# Altium schematic sheet ESP_with_usb_2.SchDoc
size A
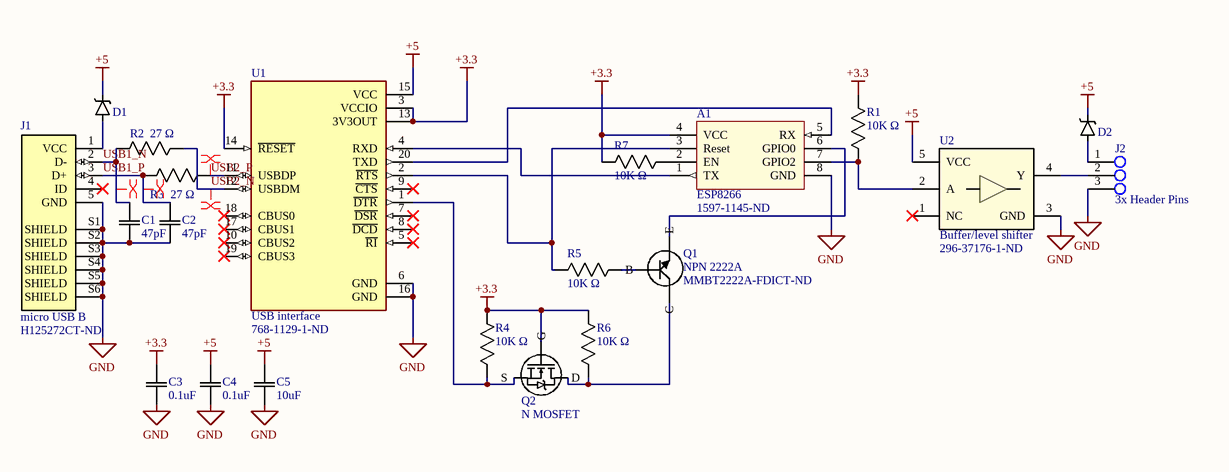
[diagram p0: ESP_with_usb_2.SchDoc]

## Parts
A1  ESP8266  Supplier Part Number 1: 1597-1145-ND  [ESP8266]
C1  47pF  [CC0805N]
C2  47pF  [CC0805N]
C3  0.1uF  [CC0805N]
C4  0.1uF  [CC0805N]
C5  10uF  [CC0805N]
D1  Diode, Schottky  [SOD-323]  (value not drawn)
D2  Diode, Schottky  [SOD-323]  (value not drawn)
J1  micro USB B  Supplier Part Number 1: H125272CT-ND  [Micro USB B (rev 2)]
J2  3x Header Pins  [3 HEADER PIN]
Q1  NPN 2222A  Supplier Part Number 1: MMBT2222A-FDICT-ND  [SOT-23-3]
Q2  N MOSFET  [SOT-323]
R1  10K Ω  [CC0805N]
R2  27 Ω  [CC0805N]
R3  27 Ω  [CC0805N]
R4  10K Ω  [CC0805N]
R5  10K Ω  [CC0805N]
R6  10K Ω  [CC0805N]
R7  10K Ω  [CC0805N]
U1  USB interface  Supplier Part Number 1: 768-1129-1-ND  [20-SSOP]
U2  Buffer/level shifter  Supplier Part Number 1: 296-37176-1-ND  [SOT-23-5]

## Nets
+3.3: A1.4(VCC) C3.2 Q2.1(G) R1.1 R4.1 R6.1 R7.1 U1.3(VCCIO) U1.13(3V3OUT) U1.14(~{RESET})
+5: C4.2 C5.2 D1.C D2.C U1.15(VCC) U2.5(VCC)
GND: A1.8(GND) C1.1 C2.1 C3.1 C4.1 C5.1 J1.5(GND) J1.S1(SHIELD) J1.S2(SHIELD) J1.S3(SHIELD) J1.S4(SHIELD) J1.S5(SHIELD) J1.S6(SHIELD) J2.3 U1.6(GND) U1.16(GND) U2.3(GND)
USB1_N: C1.2 J1.2(D-) R2.2
USB1_P: C2.2 J1.3(D+) R3.2
USB2_N: R2.1 U1.12(USBDM)
USB2_P: R3.1 U1.11(USBDP)
NetA1_1: A1.1(TX) U1.4(RXD)
NetA1_2: A1.2(EN) R7.2
NetA1_3: A1.3(Reset) R5.2 U1.2(~{RTS})
NetA1_5: A1.5(RX) U1.20(TXD)
NetA1_6: A1.6(GPIO0) Q1.2(E)
NetA1_7: A1.7(GPIO2) R1.2 U2.2(A)
NetD1_A: D1.A J1.1(VCC)
NetD2_A: D2.A J2.1
NetJ2_2: J2.2 U2.4(Y)
NetQ1_1: Q1.1(B) R5.1
NetQ1_3: Q1.3(C) Q2.3(D) R6.2
NetQ2_2: Q2.2(S) R4.2 U1.1(~{DTR})

Not connected (* = marked no-connect by the designer): J1 4(ID)*; U1 5(~{RI})* 7(~{DSR})* 8(~{DCD})* 9(~{CTS})* 10(CBUS2)* 17(CBUS1)* 18(CBUS0)* 19(CBUS3)*; U2 1(NC)*

## Layout directives
differential pair: USB1_N, USB1_P, USB2_N, USB2_P

## Library data of the parts
A1 = ESP8266: RX TXRX MODULE WIFI TRACE ANT TH; Supplier 1: Digi-Key
C1 C2 = C0805C470J5GACTU: CAP CER 47PF 50V C0G/NP0 0805; Manufacturer_Part_Number: CC0805KRX7R9BB104; Vendor: Yageo; Built_By: EMA_UL_Team; Type: DEV; Copyright: Copyright (C) 2018 Accelerated Designs. All rights reserved; RefDes: RefDes; Value: Value; Supplier 1: Digi-Key; Supplier Part Number 1: 399-1117-1-ND
C3 C4 = CC0805KRX7R9BB10: CAP CER 0.1UF 50V X7R 0805; Manufacturer_Part_Number: CC0805KRX7R9BB104; Vendor: Yageo; Built_By: EMA_UL_Team; Type: DEV; Copyright: Copyright (C) 2018 Accelerated Designs. All rights reserved; RefDes: RefDes; Value: Value; Supplier 1: Digi-Key; Supplier Part Number 1: 311-1140-1-ND
C5 = C0805C106K9PACTU: CAP CER 10UF 6.3V X5R 0805; Manufacturer_Part_Number: CC0805KRX7R9BB104; Vendor: Yageo; Built_By: EMA_UL_Team; Type: DEV; Copyright: Copyright (C) 2018 Accelerated Designs. All rights reserved; RefDes: RefDes; Value: Value; Supplier 1: Digi-Key; Supplier Part Number 1: 399-3138-1-ND
D1 D2 = BAT20JFILM: DIODE SCHOTTKY 23V 1A SOD323; MF: STMicroelectronics; Package: SOD-323 STMicroelectronics; SnapEDA_Link: https://www.snapeda.com/parts/BAT20JFILM/STMicroelectronics/view-part/110314/?ref=snap; MP: BAT20JFILM; Value: *; Availability: Unavailable; Price: None; Supplier 1: Digi-Key; Supplier Part Number 1: 497-3381-1-ND
J1 = ZX62D-B-5P8(30): CONN RCPT USB2.0 MICRO B SMD R/A; SourceLibrary: Hirose_2020-02-14; Vendor: Hirose; Built_By: EMA_Colton; Manufacturer_Part_Number: ZX62D-B-5P8(30); Copyright: Copyright (C) 2018 Accelerated Designs. All rights reserved; Datasheet: https://www.digikey.com/product-detail/en/hirose-electric-co-ltd/ZX62D-B-5P8-30/H125272TR-ND/5994738; RefDes: RefDes; Type: DEV; Supplier 1: Digi-Key
J2 = 3x Header Pin: CONN HEADER VERT 5POS 2.54MM; Manufacturer_Part_Number: 77311-818-36LF; Vendor: Amphenol; Built_By: EMA_UL_Team; SourceLibrary: Amphenol_2013-08-06_Bergstik_1Row_77311; Copyright: Copyright (C) 2018 Accelerated Designs. All rights reserved; RefDes: RefDes; Type: DEV; Value: Value
Q1 = MMBT2222A-7-F: TRANS NPN 40V 0.6A SMD SOT23-3; MF: Diodes Inc.; Package: SOT-23-3 Diodes Inc.; Digi-Key_Purchase_URL: https://www.digikey.in/product-detail/en/diodes-incorporated/MMBT2222A-7-F/MMBT2222A-FDICT-ND/815723?utm_source=snapeda&utm_medium=aggregator&utm_campaign=symbol; Value: *; MP: MMBT2222A-7-F; SnapEDA_Link: https://www.snapeda.com/parts/MMBT2222A-7-F/Diodes%20Inc./view-part/229424/?ref=snap; Digi-Key_Part_Number: MMBT2222A-FDICT-ND; Supplier 1: Digi-Key
Q2 = 2N7002PW,115: MOSFET N-CH 60V 0.31A SOT323; Manufacturer_Part_Number: 2N7002,215; Vendor: NXP; Built_By: EMA_UL_Team; SourceLibrary: NXP_2011-01-01; Type: DEV; Copyright: Copyright (C) 2018 Accelerated Designs. All rights reserved; RefDes: RefDes; Supplier 1: Digi-Key; Supplier Part Number 1: 1727-4793-1-ND
R1 R4-R7 = RC0805FR-0710KL: RES SMD 10K OHM 1% 1/8W 0805; Vendor: Yageo; Built_By: EMA_UL_Team; Manufacturer_Part_Number: RC0805FR-0710KL; Copyright: Copyright (C) 2018 Accelerated Designs. All rights reserved; RefDes: RefDes; Type: DEV; Value: Value; Supplier 1: Digi-Key; Supplier Part Number 1: 311-10.0KCRCT-ND
R2 R3 = RK73H2ATTD27R0F: RES 27 OHM 1% 1/4W 0805; Manufacturer_Part_Number: RC0805FR-0710KL; Vendor: Yageo; Built_By: EMA_UL_Team; Copyright: Copyright (C) 2018 Accelerated Designs. All rights reserved; RefDes: RefDes; Type: DEV; Value: Value; Supplier 1: Digi-Key; Supplier Part Number 1: 2019-RK73H2ATTD27R0FCT-ND
U1 = FT231XS-R: USB Bridge, USB to UART USB 2.0 UART Interface 20-SSOP; MF: FTDI,; Price: None; Package: SSOP-20 FTDI; Value: *; MP: FT231XS-R; Availability: Unavailable; SnapEDA_Link: https://www.snapeda.com/parts/FT231XS-R/FTDI%2C%20Future%20Technology%20Devices%20International%20Ltd/view-part/48872/?ref=snap; Supplier 1: Digi-Key
U2 = SN74LV1T34DBVR: IC BUF NON-INVERT 5.5V SOT23-5; Manufacturer: Texas Instruments; PIN_COUNT: 5; SymbolVerison: 2014-09-28; PartNumber: SN74LV1T34DBV; PackageReference: DBV0005A; MountType: SMT; CompType: IC; RoHS: Y; RefDes: RefDes; Type: DEV; Value: Value; Copyright: Copyright (C) 2018 Accelerated Designs. All rights reserved; Supplier 1: Digi-Key